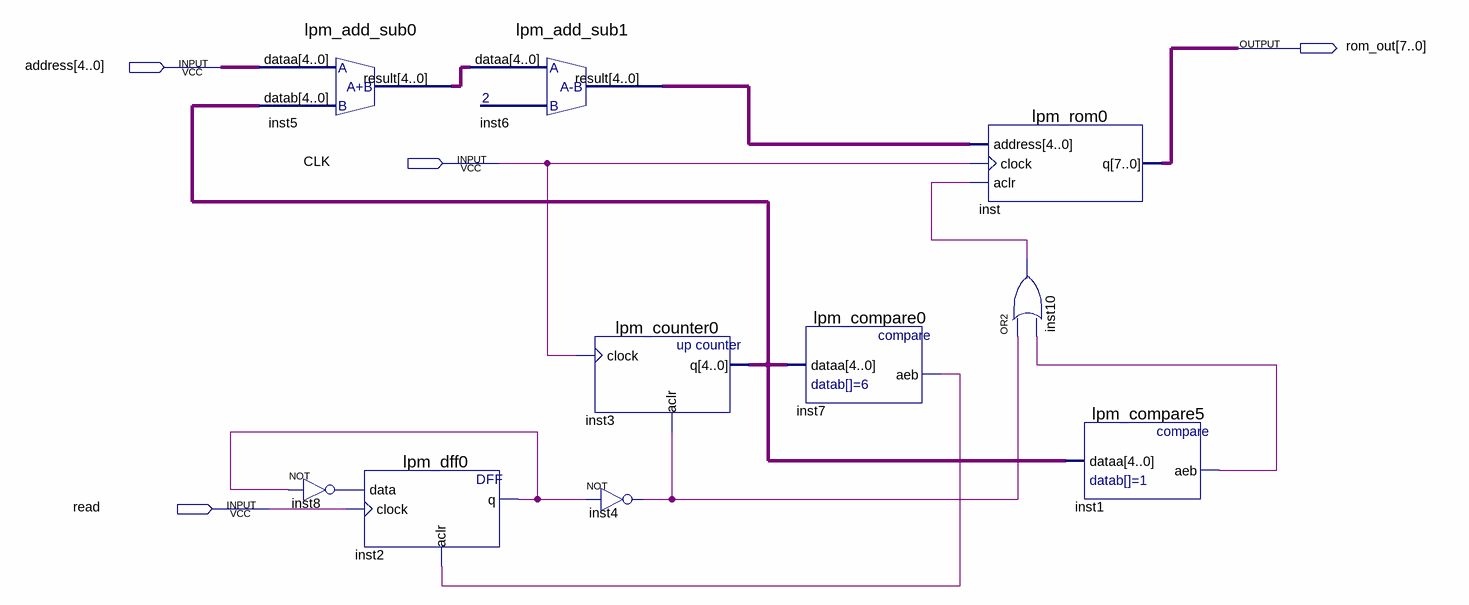
[diagram p0: schematic sheet]
// Quartus schematic rom_block.bdf as structural Verilog: 10 symbols, 4 pins
module rom_block (
  input  [4:0] address,
  input  CLK,
  input  read,
  output [7:0] rom_out
);

  wire inst1_aeb, inst2_q, inst4_out, inst7_aeb, inst8_out, inst10_out;
  wire [4:0] inst3_q, inst5_result, inst6_result;

  lpm_add_sub0 inst5 (.dataa(address), .datab(inst3_q), .result(inst5_result));
  not inst8 (inst8_out, inst2_q);
  lpm_dff0 inst2 (.data(inst8_out), .clock(read), .aclr(inst7_aeb), .q(inst2_q));
  lpm_add_sub1 inst6 (.dataa(inst5_result), .result(inst6_result));
  lpm_counter0 inst3 (.clock(CLK), .aclr(inst4_out), .q(inst3_q));
  not inst4 (inst4_out, inst2_q);
  lpm_compare0 inst7 (.dataa(inst3_q), .aeb(inst7_aeb));
  lpm_rom0 inst (.address(inst6_result), .clock(CLK), .aclr(inst10_out), .q(rom_out));
  or inst10 (inst10_out, inst4_out, inst1_aeb);
  lpm_compare5 inst1 (.dataa(inst3_q), .aeb(inst1_aeb));
endmodule
